# EAGLE design adapter (EAGLE 5.12)
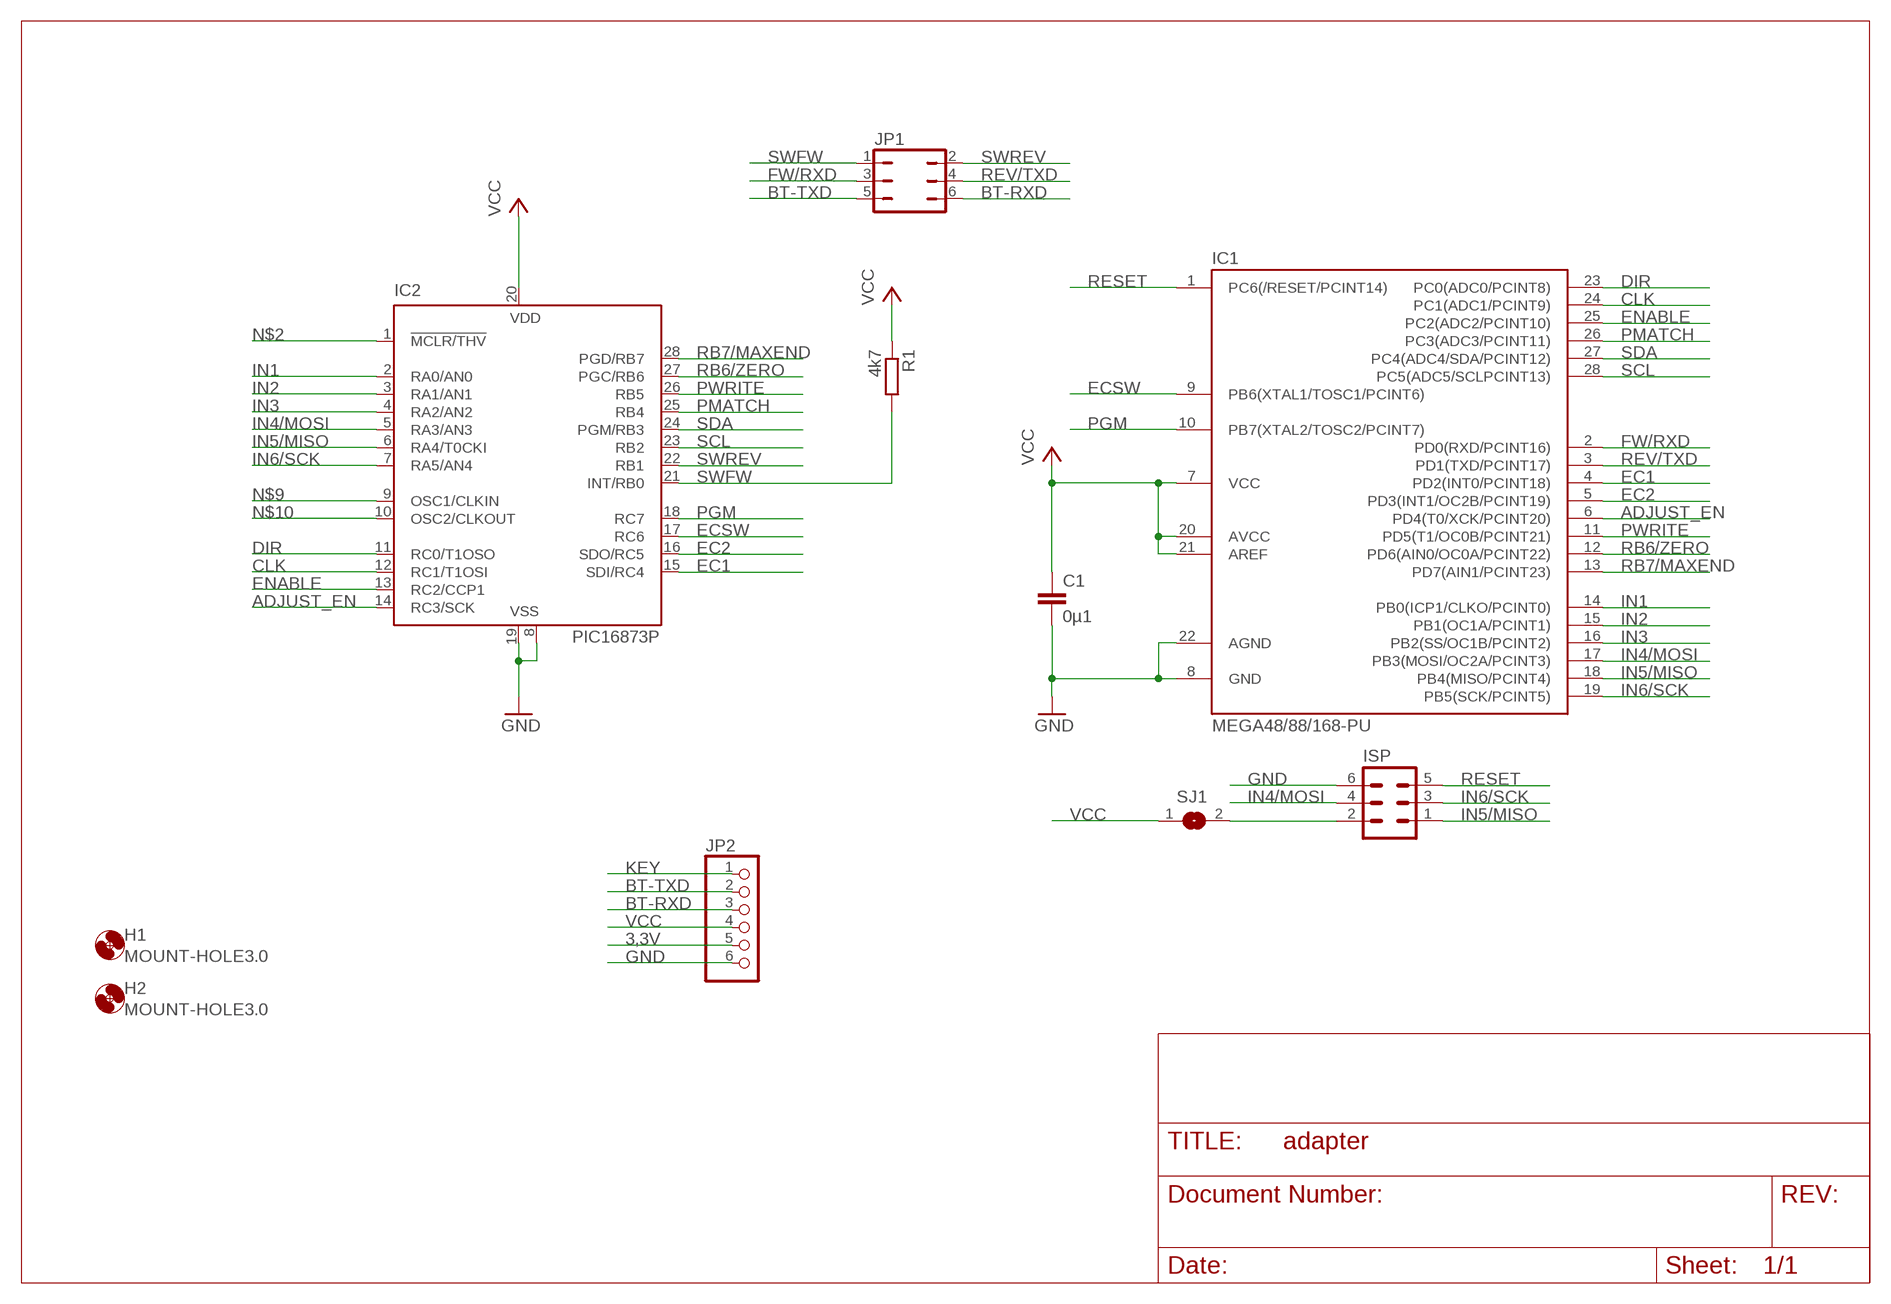
[diagram p0: schematic, sheet 1]

## Parts
C1  0µ1  C-EU025-025X050  [C025-025X050]
H1  MOUNT-HOLE3.0  [3,0]
H2  MOUNT-HOLE3.0  [3,0]
IC1  MEGA48/88/168-PU  [DIL28-3]
IC2  PIC16873P  [DIL28-3]
ISP  MA03-2  [MA03-2]
JP1  JP3Q  [JP3Q]
JP2  PINHD-1X6  [1X06]
R1  4k7  R-EU_0207/2V  [0207/2V]
SJ1  SJ  [SJ]

## Nets
3,3V: JP2.5
ADJUST_EN: IC1.6(PD4(T0/XCK/PCINT20)) IC2.14(RC3/SCK)
BT-RXD: JP1.6 JP2.3
BT-TXD: JP1.5 JP2.2
CLK: IC1.24(PC1(ADC1/PCINT9)) IC2.12(RC1/T1OSI)
DIR: IC1.23(PC0(ADC0/PCINT8)) IC2.11(RC0/T1OSO)
EC1: IC1.4(PD2(INT0/PCINT18)) IC2.15(SDI/RC4)
EC2: IC1.5(PD3(INT1/OC2B/PCINT19)) IC2.16(SDO/RC5)
ECSW: IC1.9(PB6(XTAL1/TOSC1/PCINT6)) IC2.17(RC6)
ENABLE: IC1.25(PC2(ADC2/PCINT10)) IC2.13(RC2/CCP1)
FW/RXD: IC1.2(PD0(RXD/PCINT16)) JP1.3
GND: C1.2 IC1.8(GND) IC1.22(AGND) IC2.8(VSS) IC2.19(VSS) ISP.6 JP2.6
IN1: IC1.14(PB0(ICP1/CLKO/PCINT0)) IC2.2(RA0/AN0)
IN2: IC1.15(PB1(OC1A/PCINT1)) IC2.3(RA1/AN1)
IN3: IC1.16(PB2(SS/OC1B/PCINT2)) IC2.4(RA2/AN2)
IN4/MOSI: IC1.17(PB3(MOSI/OC2A/PCINT3)) IC2.5(RA3/AN3) ISP.4
IN5/MISO: IC1.18(PB4(MISO/PCINT4)) IC2.6(RA4/T0CKI) ISP.1
IN6/SCK: IC1.19(PB5(SCK/PCINT5)) IC2.7(RA5/AN4) ISP.3
KEY: JP2.1
N$1: ISP.2 SJ1.2
N$2: IC2.1(!MCLR/THV)
N$9: IC2.9(OSC1/CLKIN)
N$10: IC2.10(OSC2/CLKOUT)
PGM: IC1.10(PB7(XTAL2/TOSC2/PCINT7)) IC2.18(RC7)
PMATCH: IC1.26(PC3(ADC3/PCINT11)) IC2.25(RB4)
PWRITE: IC1.11(PD5(T1/OC0B/PCINT21)) IC2.26(RB5)
RB6/ZERO: IC1.12(PD6(AIN0/OC0A/PCINT22)) IC2.27(PGC/RB6)
RB7/MAXEND: IC1.13(PD7(AIN1/PCINT23)) IC2.28(PGD/RB7)
RESET: IC1.1(PC6(/RESET/PCINT14)) ISP.5
REV/TXD: IC1.3(PD1(TXD/PCINT17)) JP1.4
SCL: IC1.28(PC5(ADC5/SCLPCINT13)) IC2.23(RB2)
SDA: IC1.27(PC4(ADC4/SDA/PCINT12)) IC2.24(PGM/RB3)
SWFW: IC2.21(INT/RB0) JP1.1 R1.2
SWREV: IC2.22(RB1) JP1.2
VCC: C1.1 IC1.7(VCC) IC1.20(AVCC) IC1.21(AREF) IC2.20(VDD) JP2.4 R1.1 SJ1.1

## Library data of the parts
C1 = rcl:C-EU: CAPACITOR, European symbol
H1 H2 = holes:MOUNT-HOLE: MOUNTING HOLE with drill center marker
IC1 = avr-6:MEGA48/88/168-PU
IC2 = microchip:PIC16*873: MICROCONTROLLER flash type; OC_FARNELL: unknown; OC_NEWARK: unknown
ISP = con-lstb:MA03-2: PIN HEADER; OC_FARNELL: unknown; OC_NEWARK: unknown
JP1 = jumper:JP3Q: JUMPER
JP2 = pinhead:PINHD-1X6: PIN HEADER
R1 = rcl:R-EU_: RESISTOR, European symbol
SJ1 = jumper:SJ: SMD solder JUMPER

## Net classes
0 default: width 0.305 mm, drill 0.6 mm, clearance 0.305 mm

## Board
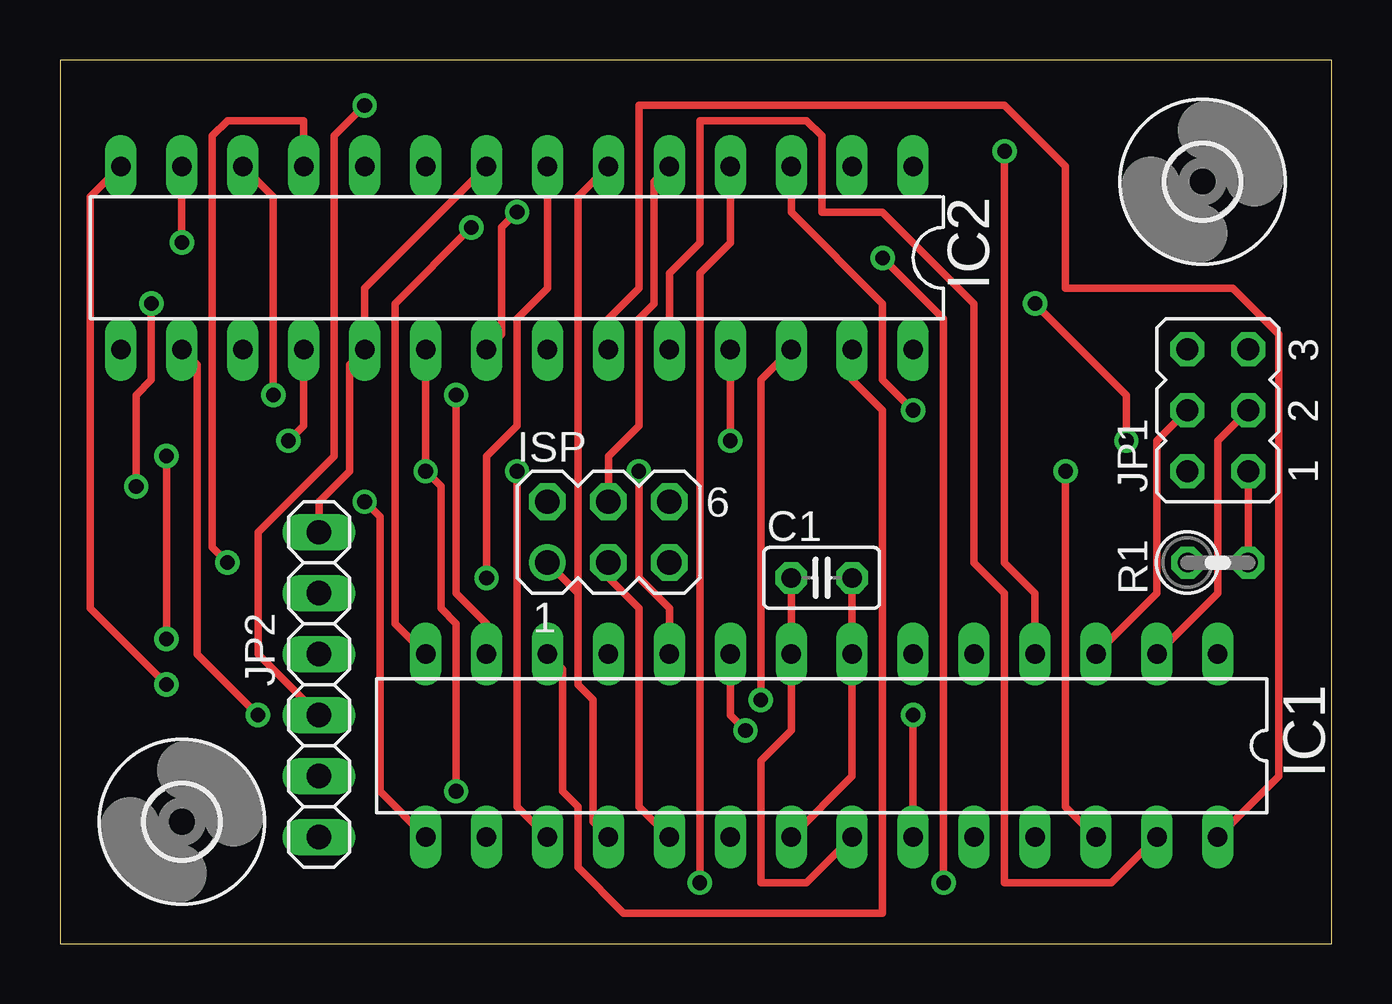
[diagram p1: board, top side]
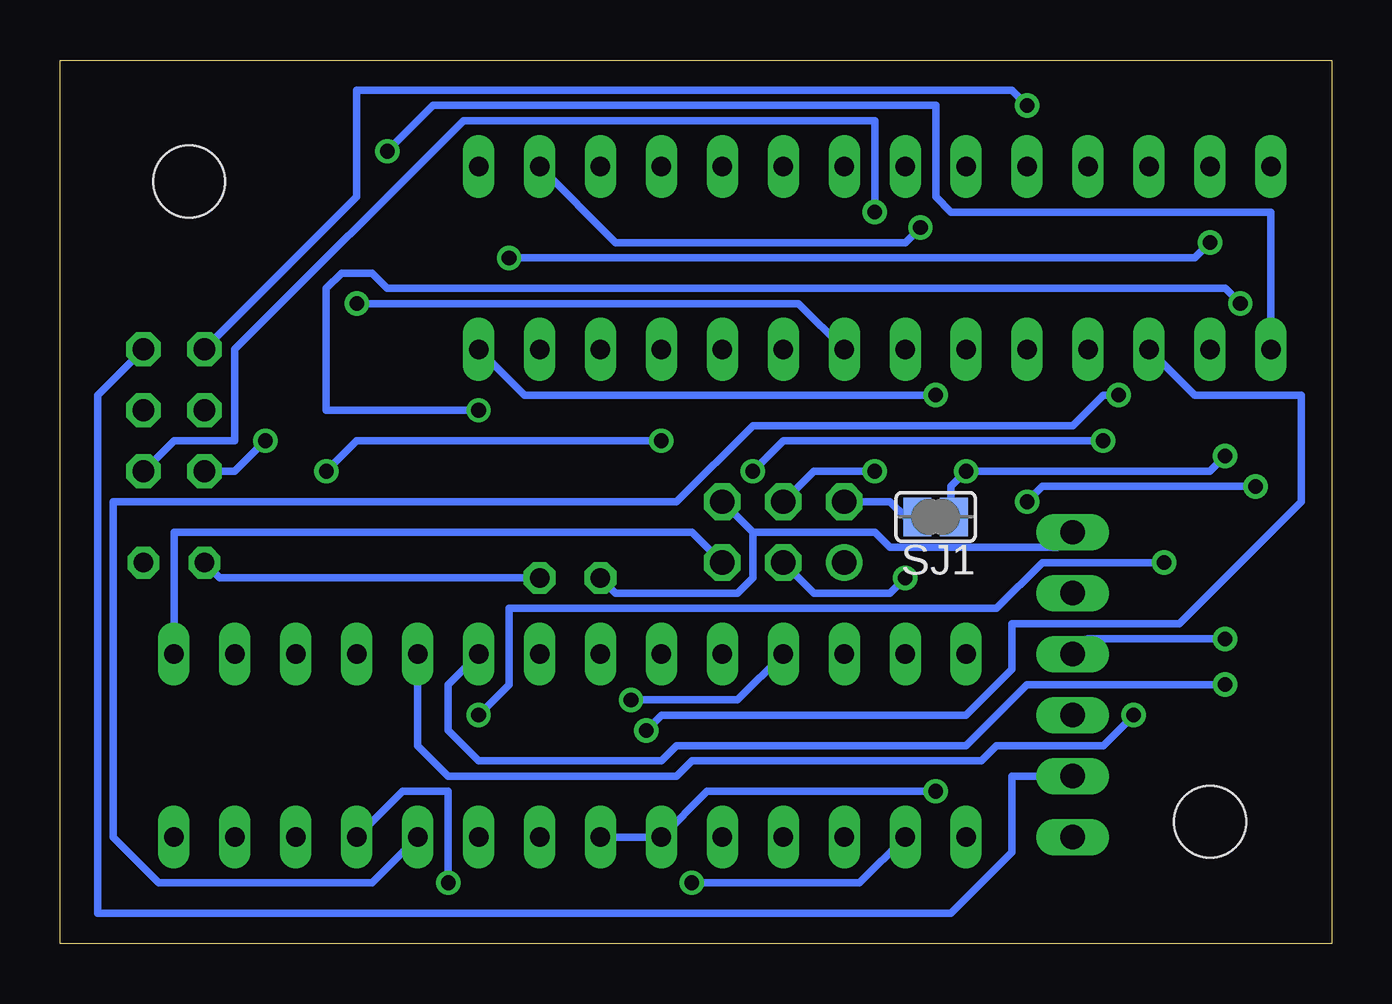
[diagram p2: board, bottom side, seen from below]

Size 53.01 x 36.82 mm. Coordinates in mm from the lower left corner, seen from the top.
Outline: 0,0 53.01,0 53.01,36.82 0,36.82 0,0
Copper layers (1*16): Top 0.035mm / dielectric 1.5mm / Bottom 0.035mm
Design rules "Bilex DRU": minimum track width 10mil, minimum drill 24mil, track to track 10mil, track to pad 10mil, pad to pad 10mil, via to via 10mil, smd to smd 10mil, copper to edge 40mil, drill to drill 8mil, minimum pad ring 10mil, minimum via ring 8mil, stop-mask expansion 4mil, vias tented up to drill 0mil, thermal gap 10mil

### Footprints (pad centres in the part's own frame; a part is rotated, then mirrored left to right if it is on the bottom)
C025-025X050 = drill 0.813 octagon: 1 -1.27,0; 2 1.27,0
3,0 = hole 3: 0,0
DIL28-3 = drill 0.813 long: 1 -16.51,-3.81; 2 -13.97,-3.81; 3 -11.43,-3.81; 4 -8.89,-3.81; 5 -6.35,-3.81; 6 -3.81,-3.81; 7 -1.27,-3.81; 8 1.27,-3.81; 9 3.81,-3.81; 10 6.35,-3.81; 11 8.89,-3.81; 12 11.43,-3.81; 13 13.97,-3.81; 14 16.51,-3.81; 15 16.51,3.81; 16 13.97,3.81; 17 11.43,3.81; 18 8.89,3.81; 19 6.35,3.81; 20 3.81,3.81; 21 1.27,3.81; 22 -1.27,3.81; 23 -3.81,3.81; 24 -6.35,3.81; 25 -8.89,3.81; 26 -11.43,3.81; 27 -13.97,3.81; 28 -16.51,3.81
MA03-2 = drill 1.016 round: 1 -2.54,-1.27 | drill 1.016 octagon: 2 -2.54,1.27; 3 0,-1.27; 4 0,1.27; 5 2.54,-1.27; 6 2.54,1.27
JP3Q = drill 0.914 octagon: 1 -2.54,-1.27; 2 -2.54,1.27; 3 0,-1.27; 4 0,1.27; 5 2.54,-1.27; 6 2.54,1.27
1X06 = drill 1.016 long: 1 -6.35,0; 2 -3.81,0; 3 -1.27,0; 4 1.27,0; 5 3.81,0; 6 6.35,0
0207/2V = drill 0.813 octagon: 1 -1.27,0; 2 1.27,0
SJ = smd 1.168 x 1.6: 1 -0.762,0; 2 0.762,0

### Placement (x,y rotation side)
C1  31.75,15.24 180 top
H1  47.62,31.75 0 top
H2  5.08,5.08 0 top
IC1  31.75,8.26 180 top
IC2  19.05,28.57 180 top
ISP  22.86,17.14 0 top
JP1  48.26,22.23 90 top
JP2  10.79,10.79 90 top
R1  48.26,15.88 0 top
SJ1  16.51,17.78 180 bottom

### Tracks (layer width: path | path; a pad name or v marks a point on that pad's centre or on a via)
ADJUST_EN  (via drill 0.61)
  Top 0.305: IC2.14 1.27,31.11 1.27,13.97 v4.45,10.79
  Bottom 0.305: v4.45,10.79 12.7,10.79 15.24,8.26 27.3,8.26 27.94,7.62 35.56,7.62 36.83,8.89 36.83,10.79 IC1.6
BT-RXD  (via drill 0.61)
  Top 0.305: v12.7,34.92 11.43,33.66 11.43,20.32 8.26,17.14 8.26,12.06 JP2.3
  Bottom 0.305: JP1.6 40.64,31.11 40.64,35.56 13.34,35.56 v12.7,34.92
BT-TXD
  Bottom 0.305: JP1.5 51.44,22.86 51.44,1.27 15.88,1.27 13.34,3.81 13.34,6.99 JP2.2
CLK  (via drill 0.61)
  Top 0.305: v8.89,22.86 8.89,31.11 IC2.12
  Bottom 0.305: IC1.24 40.01,2.54 48.9,2.54 50.8,4.45 50.8,18.41 27.3,18.41 24.13,21.59 10.79,21.59 9.53,22.86 v8.89,22.86
DIR  (via drill 0.61)
  Top 0.305: v35.56,9.53 IC1.23 | v6.99,15.88 6.35,16.51 6.35,33.66 6.99,34.29 10.16,34.29 IC2.11
  Bottom 0.305: v35.56,9.53 34.29,10.79 34.29,13.97 13.97,13.97 12.06,15.88 v6.99,15.88
EC1  (via drill 0.61)
  Top 0.305: v39.37,33.02 39.37,15.88 40.64,14.61 IC1.4
  Bottom 0.305: IC2.15 2.54,30.48 15.88,30.48 16.51,31.11 16.51,34.92 37.47,34.92 v39.37,33.02
EC2  (via drill 0.61)
  Top 0.305: IC2.16 5.71,24.13 5.71,12.06 v8.26,9.53
  Bottom 0.305: v8.26,9.53 9.53,8.26 13.97,8.26 14.61,7.62 26.67,7.62 27.3,6.99 36.83,6.99 38.1,8.26 IC1.5
ECSW  (via drill 0.61)
  Top 0.305: IC1.9 27.94,9.53 v28.57,8.89
  Bottom 0.305: v28.57,8.89 27.94,9.53 15.24,9.53 13.34,11.43 13.34,13.34 6.35,13.34 1.27,18.41 1.27,22.86 5.71,22.86 IC2.17
ENABLE  (via drill 0.61)
  Top 0.305: v5.08,29.21 IC2.13 | v34.29,28.57 36.83,26.04 v36.83,2.54
  Bottom 0.305: v5.08,29.21 5.71,28.57 v34.29,28.57 | v36.83,2.54 36.83,6.35 38.73,6.35 IC1.25
FW/RXD
  Top 0.305: IC1.2 48.26,14.61 48.26,20.95 JP1.3
GND
  Top 0.305: C1.2 IC1.8 30.48,8.89 29.21,7.62 29.21,2.54 31.11,2.54 IC1.22 | JP2.6 10.79,18.41 12.06,19.68 12.06,24.13 IC2.19 12.7,27.3 IC2.8
  Bottom 0.305: 24.13,17.14 ISP.6 | C1.2 29.84,14.61 24.77,14.61 24.13,15.24 24.13,17.14 | 24.13,17.14 19.05,17.14 18.41,16.51 11.43,16.51 JP2.6
IN1  (via drill 0.61)
  Top 0.305: IC1.14 13.97,13.34 13.97,26.67 v17.14,29.84
  Bottom 0.305: v17.14,29.84 17.78,29.21 29.84,29.21 IC2.2
IN2  (via drill 0.61)
  Top 0.305: IC1.15 13.34,6.35 13.34,17.78 v12.7,18.41 | v3.17,19.05 3.17,22.86 3.81,23.5 v3.81,26.67 | v35.56,22.23 34.29,23.5 34.29,26.67 30.48,30.48 IC2.3
  Bottom 0.305: v12.7,18.41 12.06,19.05 v3.17,19.05 | v3.81,26.67 4.45,27.3 39.37,27.3 40.01,27.94 41.27,27.94 41.91,27.3 41.91,22.23 v35.56,22.23
IN3  (via drill 0.61)
  Top 0.305: v26.67,2.54 26.67,27.94 27.94,29.21 IC2.4
  Bottom 0.305: IC1.16 19.68,2.54 v26.67,2.54
IN4/MOSI  (via drill 0.61)
  Top 0.305: IC1.17 19.05,5.71 v19.05,19.68 | IC2.5 24.77,31.75 24.77,26.67 24.13,26.04 24.13,21.59 22.86,20.32 ISP.4
  Bottom 0.305: v19.05,19.68 21.59,19.68 ISP.4
IN5/MISO
  Top 0.305: IC1.18 22.23,5.08 22.23,10.16 21.59,10.79 21.59,14.61 | 21.59,14.61 ISP.1 | IC2.6 21.59,31.11 21.59,14.61
IN6/SCK  (via drill 0.61)
  Top 0.305: IC1.19 24.13,5.71 24.13,13.97 22.86,15.24 ISP.3 | IC2.7 20.32,27.3 19.05,26.04 19.05,21.59 17.78,20.32 v17.78,15.24
  Bottom 0.305: ISP.3 21.59,14.61 18.41,14.61 v17.78,15.24
N$1
  Bottom 0.305: ISP.2 18.41,18.41 17.78,17.78 SJ1.2
PGM  (via drill 0.61)
  Top 0.305: IC1.10 25.4,13.97 24.13,15.24 v24.13,19.68 | v9.53,20.95 10.16,21.59 IC2.18
  Bottom 0.305: v24.13,19.68 22.86,20.95 v9.53,20.95
PMATCH  (via drill 0.61)
  Top 0.305: IC1.26 41.91,5.71 v41.91,19.68 | v27.94,20.95 IC2.25
  Bottom 0.305: v41.91,19.68 40.64,20.95 v27.94,20.95
PWRITE  (via drill 0.61)
  Top 0.305: v29.21,10.16 29.21,23.5 IC2.26
  Bottom 0.305: IC1.11 24.77,10.16 v29.21,10.16
RB6/ZERO
  Top 0.305: IC1.12 20.95,11.43 20.95,6.35 21.59,5.71 21.59,3.17 23.5,1.27 34.29,1.27 34.29,22.23 33.02,23.5 IC2.27
RB7/MAXEND  (via drill 0.61)
  Top 0.305: IC1.13 17.78,13.34 16.51,14.61 v16.51,22.86
  Bottom 0.305: v16.51,22.86 33.66,22.86 IC2.28
RESET
  Bottom 0.305: IC1.1 48.26,17.14 26.67,17.14 ISP.5
REV/TXD
  Top 0.305: IC1.3 45.72,14.61 45.72,20.95 JP1.4
SCL
  Top 0.305: IC1.28 50.8,6.99 50.8,25.4 48.9,27.3 41.91,27.3 41.91,32.38 39.37,34.92 24.13,34.92 24.13,27.3 22.86,26.04 IC2.23
SDA
  Top 0.305: IC1.27 43.81,2.54 39.37,2.54 39.37,14.61 38.1,15.88 38.1,26.67 34.29,30.48 31.75,30.48 31.75,33.66 31.11,34.29 26.67,34.29 26.67,29.21 25.4,27.94 IC2.24
SWFW  (via drill 0.61)
  Top 0.305: JP1.1 R1.2 | IC2.21 18.41,25.4 18.41,29.84 v19.05,30.48
  Bottom 0.305: v19.05,30.48 19.05,34.29 36.2,34.29 45.72,24.77 45.72,20.95 48.26,20.95 JP1.1
SWREV  (via drill 0.61)
  Top 0.305: v40.64,26.67 44.45,22.86 v44.45,20.95
  Bottom 0.305: IC2.22 22.23,26.67 v40.64,26.67 | v44.45,20.95 45.72,19.68 JP1.2
VCC  (via drill 0.61)
  Top 0.305: IC2.20 v15.24,19.68 15.88,19.05 15.88,13.97 16.51,13.34 v16.51,6.35 | v4.45,12.7 v4.45,20.32 | C1.1 IC1.7 33.02,6.99 IC1.21
  Bottom 0.305: JP2.4 10.16,12.7 v4.45,12.7 | v4.45,20.32 5.08,19.68 v15.24,19.68 15.88,19.05 15.88,17.78 SJ1.1 | IC1.21 IC1.20 26.04,6.35 v16.51,6.35 | R1.1 46.35,15.24 C1.1